# EasyEDA Pro project Sprig-C3 V1.0.1.epro, schematic Schematic1

## Sheets
1 P1: Board Name: Board2; Create Date: 2025-08-24; Page Name: P1; Project Name: ESP32-C3 module_2024-02-14_10-07-03; Schematic Name: Schematic1; Update Date: 2025-09-04; Company: EasyEDA.com; Page Size: A4; Version: V1.0
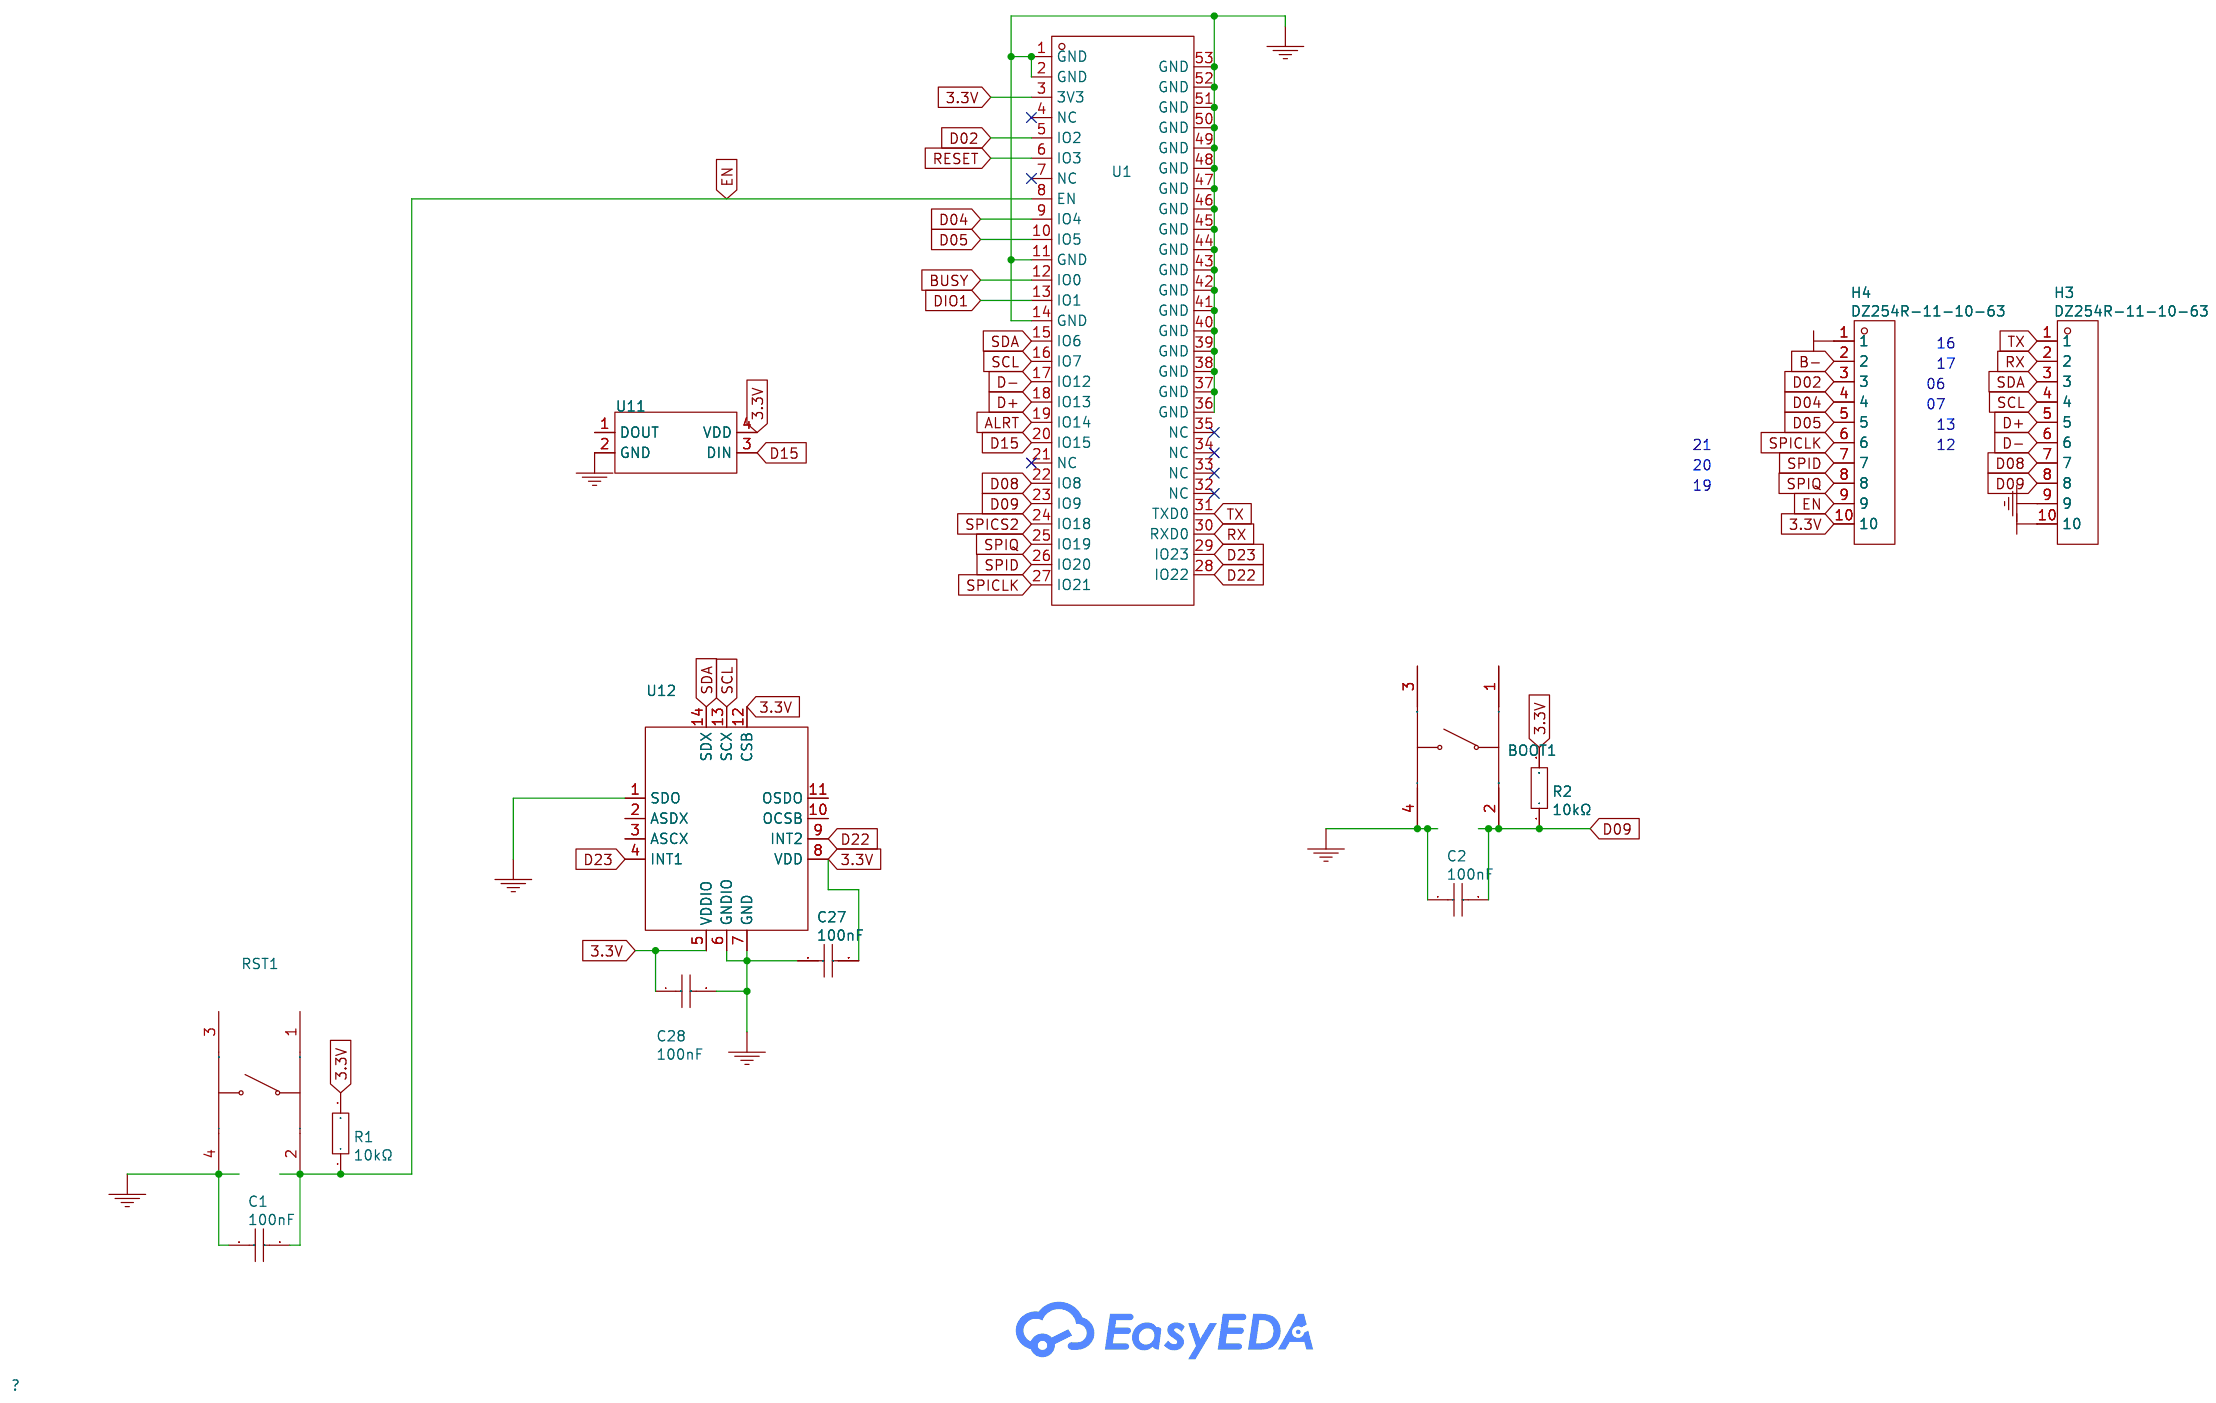
[diagram p2: P1]
2 P2: Page Name: P2; Update Date: 2025-08-31
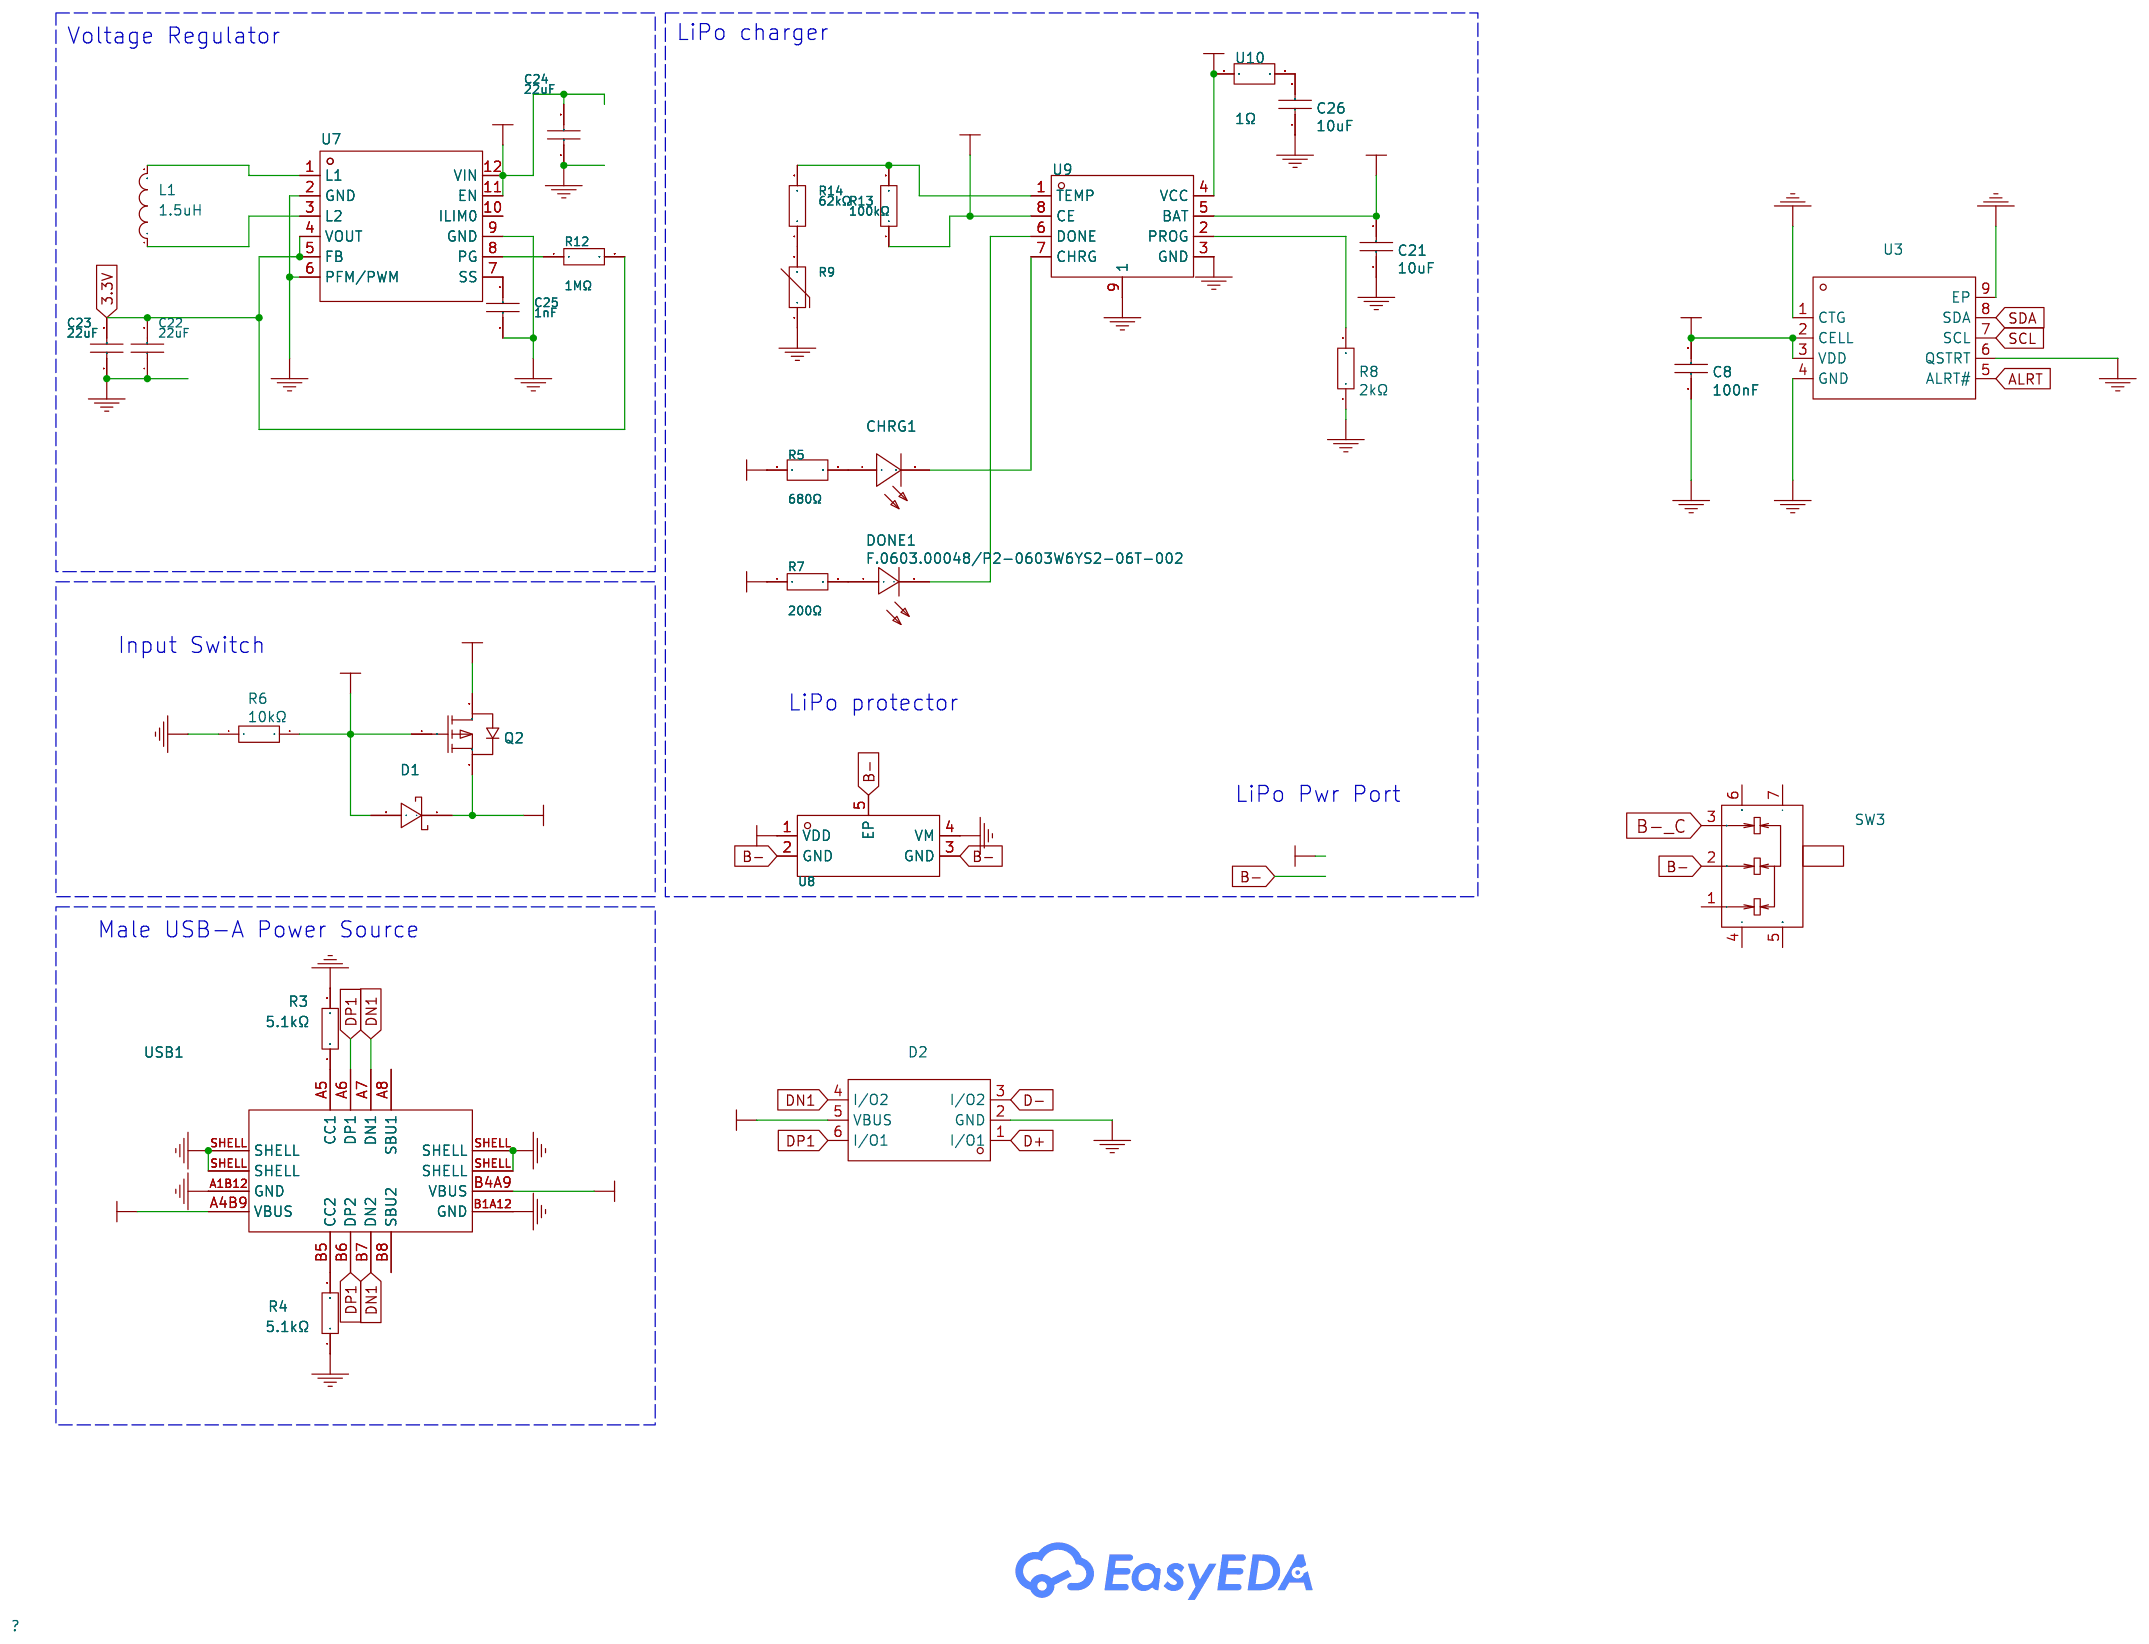
[diagram p3: P2]

## Parts
sheet P1
BOOT1  TSA016A2518C  [SW-SMD_4P-L4.2-W3.3-P2.15-LS4.6]
C1  100nF  [C0402]
C2  100nF  [C0402]
C27  100nF  [C0402]
C28  100nF  [C0402]
H3  DZ254R-11-10-63  [HDR-TH_10P-P2.54-V-M]
H4  DZ254R-11-10-63  [HDR-TH_10P-P2.54-V-M]
R1  10kΩ  [R0402]
R2  10kΩ  [R0402]
RST1  TSA016A2518C  [SW-SMD_4P-L4.2-W3.3-P2.15-LS4.6]
U1  ESP32-C6-MINI-1-N4  [WIFIM-SMD_61P-L16.6-W13.2-P0.80-ESP32-C6-MINI-1-N4]
U11  SK6805D-EC2018  [LED-SMD_4P-L2.0-W1.8-BL_SK6805D]
U12  BMI260  [LGA-14_L3.0-W2.5-P0.50-TL]
sheet P2
C8  100nF  [C0402]
C21  10uF  [C0402]
C22  22uF  [C0402]
C23  22uF  [C0402]
C24  22uF  [C0402]
C25  1nF  [C0402]
C26  10uF  [C0402]
CHRG1  NCD0603O3  [LED0603-RD]
D1  1N5819WS  [SOD-323_L1.8-W1.3-LS2.5-RD]
D2  USBLC6-2P6  [SOT-666-6_L1.6-W1.2-P0.50-LS1.6-BL]
DONE1  F.0603.00048/P2-0603W6YS2-06T-002  [LED-SMD_L1.6-W0.8-RD-WHITE-2]
L1  1.5uH  [L0806]
Q2  AO3401A  [SOT-23_L2.9-W1.3-P1.90-LS2.4-BR]
R3  5.1kΩ  [R0402]
R4  5.1kΩ  [R0402]
R5  680Ω  [R0402]
R6  10kΩ  [R0402]
R7  200Ω  [R0402]
R8  2kΩ  [R0402]
R9  FNTC0805X104F4250FB  [R0805]
R12  1MΩ  [R0402]
R13  100kΩ  [R0402]
R14  62kΩ  [R0402]
SW3  MK-12C03-G015  [SW-SMD_MK-12C03-G015]
U3  MAX17048G+T10  [DFN-8_L2.0-W2.0-P0.50-BL-EP]
U7  TPS63051RMWR  [QFN-12_L2.5-W2.5-P0.50-TL]
U8  AP6683  [DFN-4_L1.0-W1.0-P0.65-BL-EP]
U9  LGS4056H  [DFN-8_L2.0-W2.0-P0.50-TL-EP1.6]
U10  1Ω  [R0402]
USB1  U262-161N-4BVC11  [USB-3.1-SMD_U262-161N-4BVC11]

## Library data of the parts
BOOT1 RST1 = TSA016A2518C: Actuator Style:Oval button Operating Force:180gf Mounting Style:Brick nogging Switch Length:4.2mm Switch Width:3.35mm Switch Height:2.5mm Contact Current:50mA Voltage Rating (AC):- Voltage Rating (DC):12V Actuator/Cap Color:White Mechanical Life:-; LCSC Part Name: 4.2*3.35*2.5mm 立贴 轻触开关; Supplier Part: C2888430; Manufacturer: BZCN(博众电气); Supplier Footprint: SMD; JLCPCB Part Class: Extended Part; Datasheet: https://atta.szlcsc.com/upload/public/pdf/source/20210906/0198B859780D4FA617E4EB862D7350E5.pdf; Supplier: LCSC; Actuator Style: Oval button; Operating Force: 180gf; Mounting Style: Brick nogging; Switch Length: 4.2mm; Switch Width: 3.35mm; Switch Height: 2.5mm; Contact Current: 50mA; Voltage Rating (DC): 12V; Actuator/Cap Color: White
C1 C2 C8 C27 C28 = 0402B104K160NT: Capacitance:100nF Tolerance:±10% Tolerance:±10% Voltage Rated: Temperature Coefficient:; LCSC Part Name: 100nF ±10% 16V; Supplier Part: C41851; Manufacturer: FH(风华); Supplier Footprint: 0402; JLCPCB Part Class: Extended Part; Datasheet: https://atta.szlcsc.com/upload/public/pdf/source/20200305/C486355_26A10D38EF8C2A5C37091D0039909270.pdf; Supplier: LCSC; Tolerance: ±10%
H3 H4 = DZ254R-11-10-63: Supplier: LCSC; Supplier Part: C2935916; Manufacturer: DEALON(德艺隆); JLCPCB Part Class: Extended Part
R1 R2 = RMS04FT1002: Type:Thick Film Resistors Resistance: Tolerance:±1% Tolerance:±1% Power(Watts): Overload Voltage (Max): Temperature Coefficient:±100ppm/℃ Temperature Coefficient:±100ppm/℃ Operating Temperature Range:-55℃~+155℃ Operating Temperature Range:-55℃~+155℃; LCSC Part Name: 厚膜电阻 10kΩ ±1% 62.5mW; Supplier Part: C208775; Manufacturer: 大毅科技; Supplier Footprint: 0402; JLCPCB Part Class: Extended Part; Datasheet: https://atta.szlcsc.com/upload/public/pdf/source/20190313/C209057_DB28D2F9A2E1A0AF6BB7AAA99A28D7CC.pdf; Supplier: LCSC; Type: Thick Film Resistors; Tolerance: ±1%; Temperature Coefficient: ±100ppm/℃; Operating Temperature Range: -55℃~+155℃; link: https://lcsc.com/eda_search?q=C208775&amp;%26type=1&amp;ref=editor
U1 = ESP32-C6-MINI-1-N4: Supplier Part: C5736265; Manufacturer: ESPRESSIF(乐鑫); Supplier Footprint: SMD-53P; JLCPCB Part Class: Extended Part; Datasheet: https://atta.szlcsc.com/upload/public/pdf/source/20241030/4F3760582B039FB0FD0E1D65FBCFB6F4.pdf; Supplier: LCSC
U11 = SK6805D-EC2018: Wavelength:G:520nm~535nm；R:620nm~630nm；B:460nm~475nm Luminous Intensity:G:120mcd~450mcd；R:40mcd~160mcd；B:20mcd~80mcd Fixed-Frequency Pwm Mode:4kHz Data Transmission Rate:800Kbit/s Voltage - Supply:3V~7.5V Voltage - Supply:3V~7.5V Quiescent Current:0.65mA; Supplier Part: C5440835; Manufacturer: 欧思科光电; Supplier Footprint: SMD-4P,2x1.8mm; JLCPCB Part Class: Extended Part; Datasheet: https://item.szlcsc.com/datasheet/SK6805D-EC2018/6324076.html; Supplier: LCSC; Wavelength: G:520nm~535nm；R:620nm~630nm；B:460nm~475nm; Luminous Intensity: G:120mcd~450mcd；R:40mcd~160mcd；B:20mcd~80mcd; Fixed-Frequency Pwm Mode: 4kHz; Data Transmission Rate: 800Kbit/s; Voltage - Supply: 3V~7.5V; Quiescent Current: 0.65mA; ESD Withstand Voltage: 2000V; Operating Temperature: -40℃~+80℃; Length: 2mm; Width: 0.7mm; Height: 1.8mm
U12 = BMI260: LCSC Part Name: 高精度、低功耗惯性测量单元（IMU）; Supplier Part: C7544197; Manufacturer: Bosch(博世); Supplier Footprint: LGA14-(2.5x3); JLCPCB Part Class: Extended Part; Datasheet: https://item.szlcsc.com/datasheet/BMI260/8652544.html; Supplier: LCSC
C21 C26 = CL05A106MQ5NUNC: Capacitance: Tolerance:±20% Tolerance:±20% Voltage Rated: Temperature Coefficient:; LCSC Part Name: 10uF ±20% 6.3V; Supplier Part: C15525; Manufacturer: SAMSUNG(三星); Supplier Footprint: 0402; JLCPCB Part Class: Basic Part; Datasheet: https://atta.szlcsc.com/upload/public/pdf/source/20220823/2B02EE04F8F211D38A52DCB16EB6BEBA.pdf; Supplier: LCSC; Tolerance: ±20%
C22-C24 = HGC0402R5226M6R3NTEJ: Capacitance:22uF Tolerance:±20% Tolerance:±20% Voltage Rating:6.3V Temperature Coefficient:X5R; LCSC Part Name: 22uF ±20% 6.3V; Supplier Part: C7432764; Manufacturer: Chinocera(华瓷); Supplier Footprint: 0402; JLCPCB Part Class: Extended Part; Datasheet: https://atta.szlcsc.com/upload/public/pdf/source/20240320/FAC3FEC40A78BC5CCCE96C232A94D860.pdf; Supplier: LCSC; Tolerance: ±20%; Voltage Rating: 6.3V; Temperature Coefficient: X5R
C25 = CC0402KRX7R9BB102: Capacitance: Tolerance:±10% Tolerance:±10% Voltage Rated: Temperature Coefficient:; LCSC Part Name: 1nF ±10% 50V; Supplier Part: C106205; Manufacturer: YAGEO(国巨); Supplier Footprint: 0402; JLCPCB Part Class: Extended Part; Datasheet: https://atta.szlcsc.com/upload/public/pdf/source/20181008/C309510_22F155564471FAF6A489F7D68F34234E.pdf; Supplier: LCSC; Tolerance: ±10%
CHRG1 = NCD0603O3: Emitted Color:Orange Forward Voltage (VF):1.6V~2.4V Forward Voltage (VF):1.6V~2.4V Power Dissipation:65mW Forward Current:25mA Dominant Wavelength:601nm~610nm Dominant Wavelength:601nm~610nm Peak Wavelength:610nm Lens Color:无色透明透镜 Luminous Intensity:24mcd; Supplier Part: C7429913; Manufacturer: 国星光电; Supplier Footprint: 0603; JLCPCB Part Class: Extended Part; Datasheet: https://atta.szlcsc.com/upload/public/pdf/source/20230620/6A7C990163D71C49E86FABD0D2A51869.pdf; Supplier: LCSC; Emitted Color: Orange; Forward Voltage (VF): 1.6V~2.4V; Power Dissipation: 65mW; Forward Current: 25mA; Dominant Wavelength: 601nm~610nm; Peak Wavelength: 610nm; Lens Color: 无色透明透镜; Luminous Intensity: 24mcd~80mcd; Viewing Angle: 140°; Operating Temperature: -30℃~+85℃; Mounting Sytle: Positive post
D1 = 1N5819WS_C191023: Forward Voltage (Vf@If):600mV@1A Reverse Voltage (Vr):40V Average Rectified Current (Io):1A; LCSC Part Name: 电压:40V 电流:1A; Supplier Part: C191023; Manufacturer: Hottech(合科泰); Supplier Footprint: SOD-323; JLCPCB Part Class: Basic Part; Datasheet: https://atta.szlcsc.com/upload/public/pdf/source/20220428/3CB86FD8D28D653594B4E35F9D5AEFD9.pdf; Supplier: LCSC; Forward Voltage (Vf@If): 600mV@1A; Reverse Voltage (Vr): 40V; Average Rectified Current (Io): 1A
D2 = USBLC6-2P6: Type:ESD; LCSC Part Name: MSL=3; Supplier Part: C2827693; Manufacturer: TECH PUBLIC(台舟); Supplier Footprint: SOT-666-6; JLCPCB Part Class: Extended Part; Datasheet: https://atta.szlcsc.com/upload/public/pdf/source/20210810/36353A9194EA9F4E33F8AE18BE051AEA.pdf; Supplier: LCSC; Type: ESD
DONE1 = F.0603.00048/P2-0603W6YS2-06T-002: Lamp Holder Type:- Illumination Color:Ice Blue Voltage - Forward(Vf):- Voltage - Forward(Vf):- Power(Watts):- Forward Current:- Wavelength - Dominant:- Wavelength - Dominant:- Peak Wavelength:- Diode Configuration:- Lens Color:- Color Temperature:- Color; Supplier Part: C7496823; Manufacturer: TUOZHAN(拓展光电); Supplier Footprint: 0603; JLCPCB Part Class: Extended Part; Datasheet: https://item.szlcsc.com/datasheet/F.0603.00048%252FP2-0603W6YS2-06T-002/8563187.html; Supplier: LCSC; Illumination Color: Ice Blue; Viewing Angle: 120°; Operating Temperature: -40℃~+85℃
L1 = DFE201610E-1R5M=P2: Inductance: Tolerance:±20% Tolerance:±20% Rated Current:- Saturation Current (Isat):- DC Resistance (DCR):- Ratings:-; LCSC Part Name: 1.5uH ±20%; Supplier Part: C668311; Manufacturer: muRata(村田); Supplier Footprint: 0806; JLCPCB Part Class: Extended Part; Datasheet: https://atta.szlcsc.com/upload/public/pdf/source/20190513/C337891_E8F53E7A275D0CF4365E41AA9943B04D.pdf; Supplier: LCSC; Tolerance: ±20%
Q2 = AO3401A_C15127: Type: Drain Source Voltage (Vdss): Continuous Drain Current (Id): Power Dissipation (Pd): Drain Source On Resistance (RDS(on)@Vgs,Id):44mΩ@10V,4.3A Gate Threshold Voltage (Vgs(th)@Id):1.3V@250uA Total Gate Charge (Qg@Vgs):12.2nC@4.5V Input Capacitance (Ci; LCSC Part Name: P沟道 耐压:30V 电流:4A; Supplier Part: C15127; Manufacturer: AOS; Supplier Footprint: SOT-23; JLCPCB Part Class: Basic Part; Datasheet: https://atta.szlcsc.com/upload/public/pdf/source/20160507/1462613609053.pdf; Supplier: LCSC; Drain Source On Resistance (RDS(on)@Vgs,Id): 44mΩ@10V,4.3A; Gate Threshold Voltage (Vgs(th)@Id): 1.3V@250uA; Total Gate Charge (Qg@Vgs): 12.2nC@4.5V; Input Capacitance (Ciss@Vds): 1.2nF@15V; Operating Temperature: -55℃~+150℃@(Tj); image: //image.lceda.cn/szlcsc/C15127.jpg
R3 R4 = 0402WGJ0512TCE: Type:Thick Film Resistors Resistance:5.1kΩ Tolerance:±5% Tolerance:±5% Power(Watts): Overload Voltage (Max): Temperature Coefficient:±100ppm/℃ Temperature Coefficient:±100ppm/℃ Operating Temperature Range:-55℃~+155℃ Operating Temperature Range:-55℃~+155℃; LCSC Part Name: 5.1kΩ ±5% 62.5mW 厚膜电阻; Supplier Part: C25941; Manufacturer: UNI-ROYAL(厚声); Supplier Footprint: 0402; JLCPCB Part Class: Extended Part; Datasheet: https://atta.szlcsc.com/upload/public/pdf/source/20200306/C422600_1E6D84923E4A46A82E41ADD87F860B5C.pdf; Supplier: LCSC; Type: Thick Film Resistors; Tolerance: ±5%; Temperature Coefficient: ±100ppm/℃; Operating Temperature Range: -55℃~+155℃; Resistance: 5.1K
R5 = RC-02K681JT: Type:Thick Film Resistors Resistance: Tolerance:±5% Tolerance:±5% Power(Watts): Overload Voltage (Max): Temperature Coefficient:±100ppm/℃ Temperature Coefficient:±100ppm/℃ Operating Temperature Range:-55℃~+155℃ Operating Temperature Range:-55℃~+155℃; LCSC Part Name: 厚膜电阻 680Ω ±5% 62.5mW; Supplier Part: C453746; Manufacturer: FH(风华); Supplier Footprint: 0402; JLCPCB Part Class: Extended Part; Datasheet: https://atta.szlcsc.com/upload/public/pdf/source/20140616/1457707091974.pdf; Supplier: LCSC; Type: Thick Film Resistors; Tolerance: ±5%; Temperature Coefficient: ±100ppm/℃; Operating Temperature Range: -55℃~+155℃
R6 = RMS04FT1002: Type:Thick Film Resistors Resistance: Tolerance:±1% Tolerance:±1% Power(Watts): Overload Voltage (Max): Temperature Coefficient:±100ppm/℃ Temperature Coefficient:±100ppm/℃ Operating Temperature Range:-55℃~+155℃ Operating Temperature Range:-55℃~+155℃; LCSC Part Name: 厚膜电阻 10kΩ ±1% 62.5mW; Supplier Part: C208775; Manufacturer: 大毅科技; Supplier Footprint: 0402; JLCPCB Part Class: Extended Part; Datasheet: https://atta.szlcsc.com/upload/public/pdf/source/20190313/C209057_DB28D2F9A2E1A0AF6BB7AAA99A28D7CC.pdf; Supplier: LCSC; Type: Thick Film Resistors; Tolerance: ±1%; Temperature Coefficient: ±100ppm/℃; Operating Temperature Range: -55℃~+155℃
R7 = 0402WGF2000TCE: Type:Thick Film Resistors Resistance: Tolerance:±1% Tolerance:±1% Power(Watts): Overload Voltage (Max): Temperature Coefficient:±100ppm/℃ Temperature Coefficient:±100ppm/℃ Operating Temperature Range:-55℃~+155℃ Operating Temperature Range:-55℃~+155℃; LCSC Part Name: 200Ω ±1% 62.5mW 厚膜电阻; Supplier Part: C25087; Manufacturer: UNI-ROYAL(厚声); Supplier Footprint: 0402; JLCPCB Part Class: Basic Part; Datasheet: https://atta.szlcsc.com/upload/public/pdf/source/20200306/C422600_1E6D84923E4A46A82E41ADD87F860B5C.pdf; Supplier: LCSC; Type: Thick Film Resistors; Tolerance: ±1%; Temperature Coefficient: ±100ppm/℃; Operating Temperature Range: -55℃~+155℃
R8 = 0402WGF2001TCE: Type:Thick Film Resistors Resistance:2kΩ Tolerance:±1% Tolerance:±1% Power(Watts): Overload Voltage (Max): Temperature Coefficient:±100ppm/℃ Temperature Coefficient:±100ppm/℃ Operating Temperature Range:-55℃~+155℃ Operating Temperature Range:-55℃~+155℃; LCSC Part Name: 2kΩ ±1% 62.5mW 厚膜电阻; Supplier Part: C4109; Manufacturer: UNI-ROYAL(厚声); Supplier Footprint: 0402; JLCPCB Part Class: Basic Part; Datasheet: https://atta.szlcsc.com/upload/public/pdf/source/20200306/C422600_1E6D84923E4A46A82E41ADD87F860B5C.pdf; Supplier: LCSC; Type: Thick Film Resistors; Tolerance: ±1%; Temperature Coefficient: ±100ppm/℃; Operating Temperature Range: -55℃~+155℃
R9 = FNTC0805X104F4250FB: Resistance @ 25℃: B Constant (25℃/50℃): Resistance Tolerance: Power: B Constant Tolerance: Operating Temperature:-40℃~+125℃ Operating Temperature:-40℃~+125℃; Supplier Part: C41417469; Manufacturer: cjiang(长江微电); Supplier Footprint: 0805; Datasheet: https://atta.szlcsc.com/upload/public/pdf/source/20240927/680ED90FE3621BD417EAE7BF117A336D.pdf; Supplier: LCSC; Operating Temperature: -40℃~+125℃
R12 = 0402WGF1004TCE: Type:Thick Film Resistors Resistance:1MΩ Tolerance:±1% Tolerance:±1% Power(Watts): Overload Voltage (Max): Temperature Coefficient:±100ppm/℃ Temperature Coefficient:±100ppm/℃ Operating Temperature Range:-55℃~+155℃ Operating Temperature Range:-55℃~+155℃; LCSC Part Name: 1MΩ ±1% 62.5mW 厚膜电阻; Supplier Part: C26083; Manufacturer: UNI-ROYAL(厚声); Supplier Footprint: 0402; JLCPCB Part Class: Basic Part; Datasheet: https://atta.szlcsc.com/upload/public/pdf/source/20200306/C422600_1E6D84923E4A46A82E41ADD87F860B5C.pdf; Supplier: LCSC; Type: Thick Film Resistors; Tolerance: ±1%; Temperature Coefficient: ±100ppm/℃; Operating Temperature Range: -55℃~+155℃
R13 = 0402WGF1003TCE: Type:Thick Film Resistors Resistance:100kΩ Tolerance:±1% Tolerance:±1% Power(Watts): Overload Voltage (Max): Temperature Coefficient:±100ppm/℃ Temperature Coefficient:±100ppm/℃ Operating Temperature Range:-55℃~+155℃ Operating Temperature Range:-55℃~+155℃; LCSC Part Name: 100kΩ ±1% 62.5mW 厚膜电阻; Supplier Part: C25741; Manufacturer: UNI-ROYAL(厚声); Supplier Footprint: 0402; JLCPCB Part Class: Basic Part; Datasheet: https://atta.szlcsc.com/upload/public/pdf/source/20200306/C422600_1E6D84923E4A46A82E41ADD87F860B5C.pdf; Supplier: LCSC; Type: Thick Film Resistors; Tolerance: ±1%; Temperature Coefficient: ±100ppm/℃; Operating Temperature Range: -55℃~+155℃
R14 = ERJ2RKF6202X: Type:Thick Film Resistors Resistance:62kΩ Tolerance:±1% Tolerance:±1% Power(Watts): Overload Voltage (Max):- Temperature Coefficient:±100ppm/℃ Temperature Coefficient:±100ppm/℃ Operating Temperature Range:-55℃~+155℃ Operating Temperature Range:-55℃~+155℃; LCSC Part Name: 62kΩ ±1% 100mW 厚膜电阻; Supplier Part: C77604; Manufacturer: PANASONIC(松下); Supplier Footprint: 0402; JLCPCB Part Class: Extended Part; Datasheet: https://atta.szlcsc.com/upload/public/pdf/source/20190222/C77604_215DF19229BE9E910CAA70C582100C6C.pdf; Supplier: LCSC; Type: Thick Film Resistors; Tolerance: ±1%; Temperature Coefficient: ±100ppm/℃; Operating Temperature Range: -55℃~+155℃
SW3 = MK-12C03-G015: Circuit:SPDT Actuator Style:Rectangular columnar Pin Style:SMDSplicing Switch Length:6.65mm Switch Width:2.75mm Switch Height:4.25mm Mounting Style:卧贴 Actuator Color:White Current Rating (DC):1A Voltage Rating (DC):6V Mechanical Life:1万次 Operating Tempera; LCSC Part Name: 新七脚小拨动开关 G1.5mm; Supplier Part: C2890358; Manufacturer: G-Switch(品赞); Supplier Footprint: SMD; JLCPCB Part Class: Extended Part; Datasheet: https://atta.szlcsc.com/upload/public/pdf/source/20240612/7D979AF25627BA0CE326E7EBF8EC90FA.pdf; Supplier: LCSC; Circuit: SPDT; Actuator Style: Rectangular columnar; Pin Style: SMDSplicing; Switch Length: 6.65mm; Switch Width: 2.75mm; Switch Height: 4.25mm; Mounting Style: 卧贴; Actuator Color: White; Current Rating (DC): 1A; Voltage Rating (DC): 6V; Mechanical Life: 1万次; Operating Temperature: -20℃~+70℃
U3 = MAX17048G+T10: The Chip Type:电池监测芯片 Type of Battery:锂离子/Polymer Number of Cells:1 Number of Cells:1 Operating Temperature:-20℃~+70℃ Operating Temperature:-20℃~+70℃; Supplier Part: C2682616; Manufacturer: ADI(亚德诺)/MAXIM(美信); Supplier Footprint: DFN-8-EP(2x2); JLCPCB Part Class: Extended Part; Datasheet: https://atta.szlcsc.com/upload/public/pdf/source/20210106/C2682616_818568B5D3BA4B627110FCAA33E0BFB1.pdf; Supplier: LCSC; The Chip Type: 电池监测芯片; Type of Battery: 锂离子/Polymer; Number of Cells: 1; Operating Temperature: -20℃~+70℃; link: https://lcsc.com/eda_search?q=C2682616&amp;%26type=1&amp;ref=editor
U7 = TPS63051RMWR: Function:Buck-boost type Output Type:Fixed Input Voltage:2.5V~5.5V Input Voltage:2.5V~5.5V Output Voltage:3.3V Output Voltage:3.3V Output Current (Max):500mA Switching Frequency:2.5MHz Operating Temperature:-40℃~+85℃@(TA) Operating Temperature:-40℃~+85℃@(; Supplier Part: C139412; Manufacturer: TI(德州仪器); Supplier Footprint: QFN-12(2.5x2.5); JLCPCB Part Class: Extended Part; Datasheet: https://www.ti.com/cn/lit/gpn/tps63051; Supplier: LCSC; Function: Buck-boost type; Output Type: Fixed; Input Voltage: 2.5V~5.5V; Output Voltage: 3.3V; Output Current (Max): 500mA; Switching Frequency: 2.5MHz; Operating Temperature: -40℃~+85℃@(TA); Synchronous Rectification: Yes; Number of Outputs: 1; Topology: Step-down-Boost; Switch tube (built-in/external): 内置
U8 = AP6683: Supplier Part: C2849565; Manufacturer: ALLPOWER(铨力); Supplier Footprint: DFN-4-EP(1x1); JLCPCB Part Class: Extended Part; Datasheet: https://atta.szlcsc.com/upload/public/pdf/source/20210723/C2849565_EA604836CC73D2108C5387801D1EBC6A.pdf; Supplier: LCSC
U9 = LGS4056H: The Chip Type:线性充电芯片 Supply Voltage:4V~6V Supply Voltage:4V~6V Maximum Charge Current:1A Charging Saturation Voltage:4.2V Type of Battery:锂离子/Polymer Number of Cells:1 Number of Cells:1 Operating Temperature:-40℃~+125℃ Operating Temperature:-40℃~+125℃; LCSC Part Name: TP4056H(DFN); Supplier Part: C5124109; Manufacturer: Legend-Si(棱晶半导体); Supplier Footprint: DFN-8(2x2); JLCPCB Part Class: Extended Part; Datasheet: https://atta.szlcsc.com/upload/public/pdf/source/20230407/EF281A5928E4D64337F5505487E44644.pdf; Supplier: LCSC; The Chip Type: 线性充电芯片; Supply Voltage: 4V~6V; Maximum Charge Current: 1A; Charging Saturation Voltage: 4.2V; Type of Battery: 锂离子/Polymer; Number of Cells: 1; Operating Temperature: -40℃~+125℃
U10 = FRC0402F1R00TS: Type:Thick Film Resistors Resistance: Tolerance:±1% Tolerance:±1% Power(Watts): Overload Voltage (Max): Temperature Coefficient:±200ppm/℃ Temperature Coefficient:±200ppm/℃ Operating Temperature Range:-55℃~+155℃ Operating Temperature Range:-55℃~+155℃; LCSC Part Name: 1Ω ±1% 62.5mW 厚膜电阻; Supplier Part: C2909329; Manufacturer: FOJAN(富捷); Supplier Footprint: 0402; JLCPCB Part Class: Extended Part; Datasheet: https://atta.szlcsc.com/upload/public/pdf/source/20211221/925EC7D7225764EE0046F22065062C87.pdf; Supplier: LCSC; Type: Thick Film Resistors; Tolerance: ±1%; Temperature Coefficient: ±200ppm/℃; Operating Temperature Range: -55℃~+155℃
USB1 = U262-161N-4BVC11: Connector Type:Type-C Standard:USB 3.1 Gender:Female Number of Ports:1 Number of Contacts:16P Mounting Style:卧贴 Current Rating - Power (Max):3A Contact Material:Copper Alloy Contact Plating:Gold Operating Temperature Range:-40℃~+85℃ Operating Temperature; LCSC Part Name: Type-C 母 卧贴; Supplier Part: C319148; Manufacturer: XKB Connectivity(中国星坤); Supplier Footprint: SMD; JLCPCB Part Class: Extended Part; Datasheet: https://atta.szlcsc.com/upload/public/pdf/source/20211015/B478CBA0F1623DA36A6CC6918C49C838.pdf; Supplier: LCSC; Connector Type: Type-C; Standard: USB 3.1; Gender: Female; Number of Ports: 1; Number of Contacts: 16P; Mounting Style: 卧贴; Current Rating - Power (Max): 3A; Contact Material: Copper Alloy; Contact Plating: Gold; Operating Temperature Range: -40℃~+85℃; Soldering Temperature(Max): 260℃

## Nets
3.3V: C22.2 C23.2 C27.2 C28.1 H4.10 R1.2 R2.2 R12.2 U1.3(3V3) U7.4(VOUT) U7.5(FB) U11.4(VDD) U12.5(VDDIO) U12.8(VDD) U12.12(CSB)
GND: BOOT1.4 C1.1 C2.1 C8.1 C21.1 C22.1 C23.1 C24.1 C25.1 C26.1 C27.1 C28.2 D2.2(GND) H3.9 R3.2 R4.1 R6.1 R8.1 R9.1 RST1.4 U1.1(GND) U1.2(GND) U1.11(GND) U1.14(GND) U1.36(GND) U1.37(GND) U1.38(GND) U1.39(GND) U1.40(GND) U1.41(GND) U1.42(GND) U1.43(GND) U1.44(GND) U1.45(GND) U1.46(GND) U1.47(GND) U1.48(GND) U1.49(GND) U1.50(GND) U1.51(GND) U1.52(GND) U1.53(GND) U3.1(CTG) U3.4(GND) U3.6(QSTRT) U3.9(EP) U7.2(GND) U7.6(PFM/PWM) U7.9(GND) U8.4(VM) U9.3(GND) U9.9(1) U11.2(GND) U12.1(SDO) U12.6(GNDIO) U12.7(GND) USB1.A1B12(GND) USB1.B1A12(GND) USB1.SHELL
VBAT: C8.2 C21.2 H4.1 Q2.3(D) U3.2(CELL) U3.3(VDD) U8.1(VDD) U9.5(BAT)
VCC: D1.2(+) D2.5(VBUS) H3.10 Q2.1(G) R5.1 R6.2 R7.1 R13.1 U9.4(VCC) U9.8(CE) U10.1 USB1.A4B9(VBUS) USB1.B4A9(VBUS)
VIN: C24.2 D1.1(-) Q2.2(S) U7.11(EN) U7.12(VIN)
ALRT: U1.19(IO14) U3.5(ALRT#)
B-: H4.2 SW3.2 U8.2(GND) U8.3(GND) U8.5(EP)
B-_C: SW3.3
BUSY: U1.12(IO0)
D02: H4.3 U1.5(IO2)
D04: H4.4 U1.9(IO4)
D05: H4.5 U1.10(IO5)
D08: H3.7 U1.22(IO8)
D09: BOOT1.2 C2.2 H3.8 R2.1 U1.23(IO9)
D15: U1.20(IO15) U11.3(DIN)
D22: U1.28(IO22) U12.9(INT2)
D23: U1.29(IO23) U12.4(INT1)
D+: D2.1(I/O1) H3.5 U1.18(IO13)
D-: D2.3(I/O2) H3.6 U1.17(IO12)
DIO1: U1.13(IO1)
DN1: D2.4(I/O2) USB1.A7(DN1) USB1.B7(DN2)
DP1: D2.6(I/O1) USB1.A6(DP1) USB1.B6(DP2)
EN: C1.2 H4.9 R1.1 RST1.2 U1.8(EN)
RESET: U1.6(IO3)
RX: H3.2 U1.30(RXD0)
SCL: H3.4 U1.16(IO7) U3.7(SCL) U12.13(SCX)
SDA: H3.3 U1.15(IO6) U3.8(SDA) U12.14(SDX)
SPICLK: H4.6 U1.27(IO21)
SPICS2: U1.24(IO18)
SPID: H4.7 U1.26(IO20)
SPIQ: H4.8 U1.25(IO19)
TX: H3.1 U1.31(TXD0)
$2N1916: R3.1 USB1.A5(CC1)
$2N1918: R4.2 USB1.B5(CC2)
$2N1927: L1.1 U7.3(L2)
$2N1928: L1.2 U7.1(L1)
$2N1932: R12.1 U7.8(PG)
$2N1935: C25.2 U7.7(SS)
$2N1945: C26.2 U10.2
$2N1946: R8.2 U9.2(PROG)
$2N1948: R13.2 R14.2 U9.1(TEMP)
$2N1949: R9.2 R14.1
Net-(CHRG1-1): CHRG1.1(A) R5.2
Net-(CHRG1-2): CHRG1.2(K) U9.7(CHRG)
Net-(DONE1-1): DONE1.1(+) R7.2
Net-(DONE1-2): DONE1.2(-) U9.6(DONE)

Not connected (* = marked no-connect by the designer): BOOT1 1 3; RST1 1 3; SW3 1 4 5 6 7; U1 4(NC)* 7(NC)* 21(NC)* 32(NC)* 33(NC)* 34(NC)* 35(NC)*; U7 10(ILIM0); U11 1(DOUT); U12 2(ASDX) 3(ASCX) 10(OCSB) 11(OSDO); USB1 A8(SBU1) B8(SBU2)

## Notes on the sheets
sheet 1
- 16
- 17
- 06
- 07
- 13
- 21
- 12
- 20
- 19
sheet 2
- Voltage Regulator
- LiPo charger
- Input Switch
- LiPo protector
- LiPo Pwr Port
- Male USB-A Power Source
